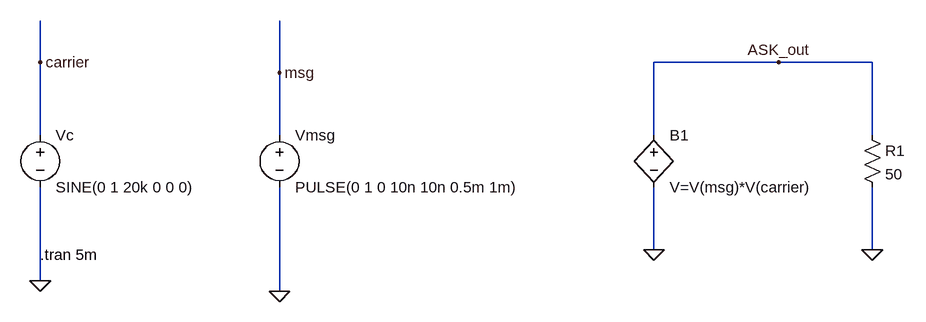
[diagram p0: schematic ASK.asc]
ASK.asc, the LTspice schematic file:
Version 4.1
SHEET 1 1432 680
WIRE 96 -16 96 -80
WIRE 1232 -16 1040 -16
WIRE 1376 -16 1232 -16
WIRE 464 0 464 -80
WIRE 96 96 96 -16
WIRE 464 96 464 0
WIRE 1040 96 1040 -16
WIRE 1376 96 1376 -16
WIRE 1040 272 1040 176
WIRE 1376 272 1376 176
WIRE 96 320 96 176
WIRE 464 336 464 176
FLAG 96 320 0
FLAG 96 -16 carrier
FLAG 464 336 0
FLAG 464 0 msg
FLAG 1040 272 0
FLAG 1376 272 0
FLAG 1232 -16 ASK_out
SYMBOL voltage 96 80 R0
WINDOW 123 0 0 Left 0
WINDOW 39 0 0 Left 0
SYMATTR InstName Vc
SYMATTR Value SINE(0 1 20k 0 0 0)
SYMBOL voltage 464 80 R0
WINDOW 123 0 0 Left 0
WINDOW 39 0 0 Left 0
SYMATTR InstName Vmsg
SYMATTR Value PULSE(0 1 0 10n 10n 0.5m 1m)
SYMBOL bv 1040 80 R0
SYMATTR InstName B1
SYMATTR Value V=V(msg)*V(carrier)
SYMBOL res 1360 80 R0
SYMATTR InstName R1
SYMATTR Value 50
TEXT 96 280 Left 2 !.tran 5m

The netlist it stands for:
* ASK.asc
Vc carrier 0 SINE(0 1 20k 0 0 0)
Vmsg msg 0 PULSE(0 1 0 10n 10n 0.5m 1m)
B1 ASK_out 0 V=V(msg)*V(carrier)
R1 ASK_out 0 50
.tran 5m
.backanno
.end